# Altium project PCB_TeknoFest.PrjPcb
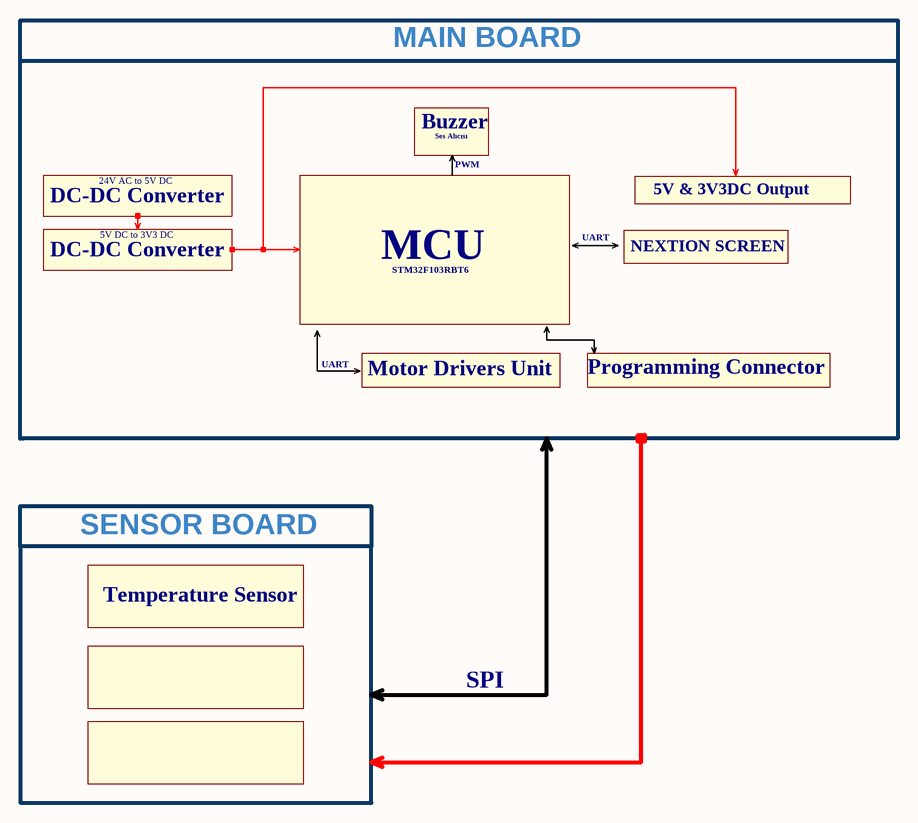
[diagram p0: BlockDiagram.SchDoc]
4 sheets, 69 parts. Net scope: flat (ports and power ports of the same name join across sheets).
Board file: TeknoFest.PcbDoc
Sheets:
  BlockDiagram.SchDoc
  MicroController.SchDoc
  PowerManagement.SchDoc
  MotorDriversUnit.SchDoc

## Sheet BlockDiagram.SchDoc
size A4; SheetNumber: 1; SheetTotal: 4

### Notes on the sheet
- MAIN BOARD
- Buzzer
- 24V AC to 5V DC
- Ses Alıcısı
- PWM
- 5V & 3V3DC Output
- DC-DC Converter
- 5V DC to 3V3 DC
- MCU
- UART
- NEXTION SCREEN
- STM32F103RBT6
- Motor Drivers Unit
- Programming Connector
- SENSOR BOARD
- Temperature Sensor
- SPI

## Sheet MicroController.SchDoc: Teknofest Project
size 381 x 241 mm; Date: 21/12/2023; SheetNumber: 2; SheetTotal: 4; Prepared by: Mustafa Oğuz Ateş
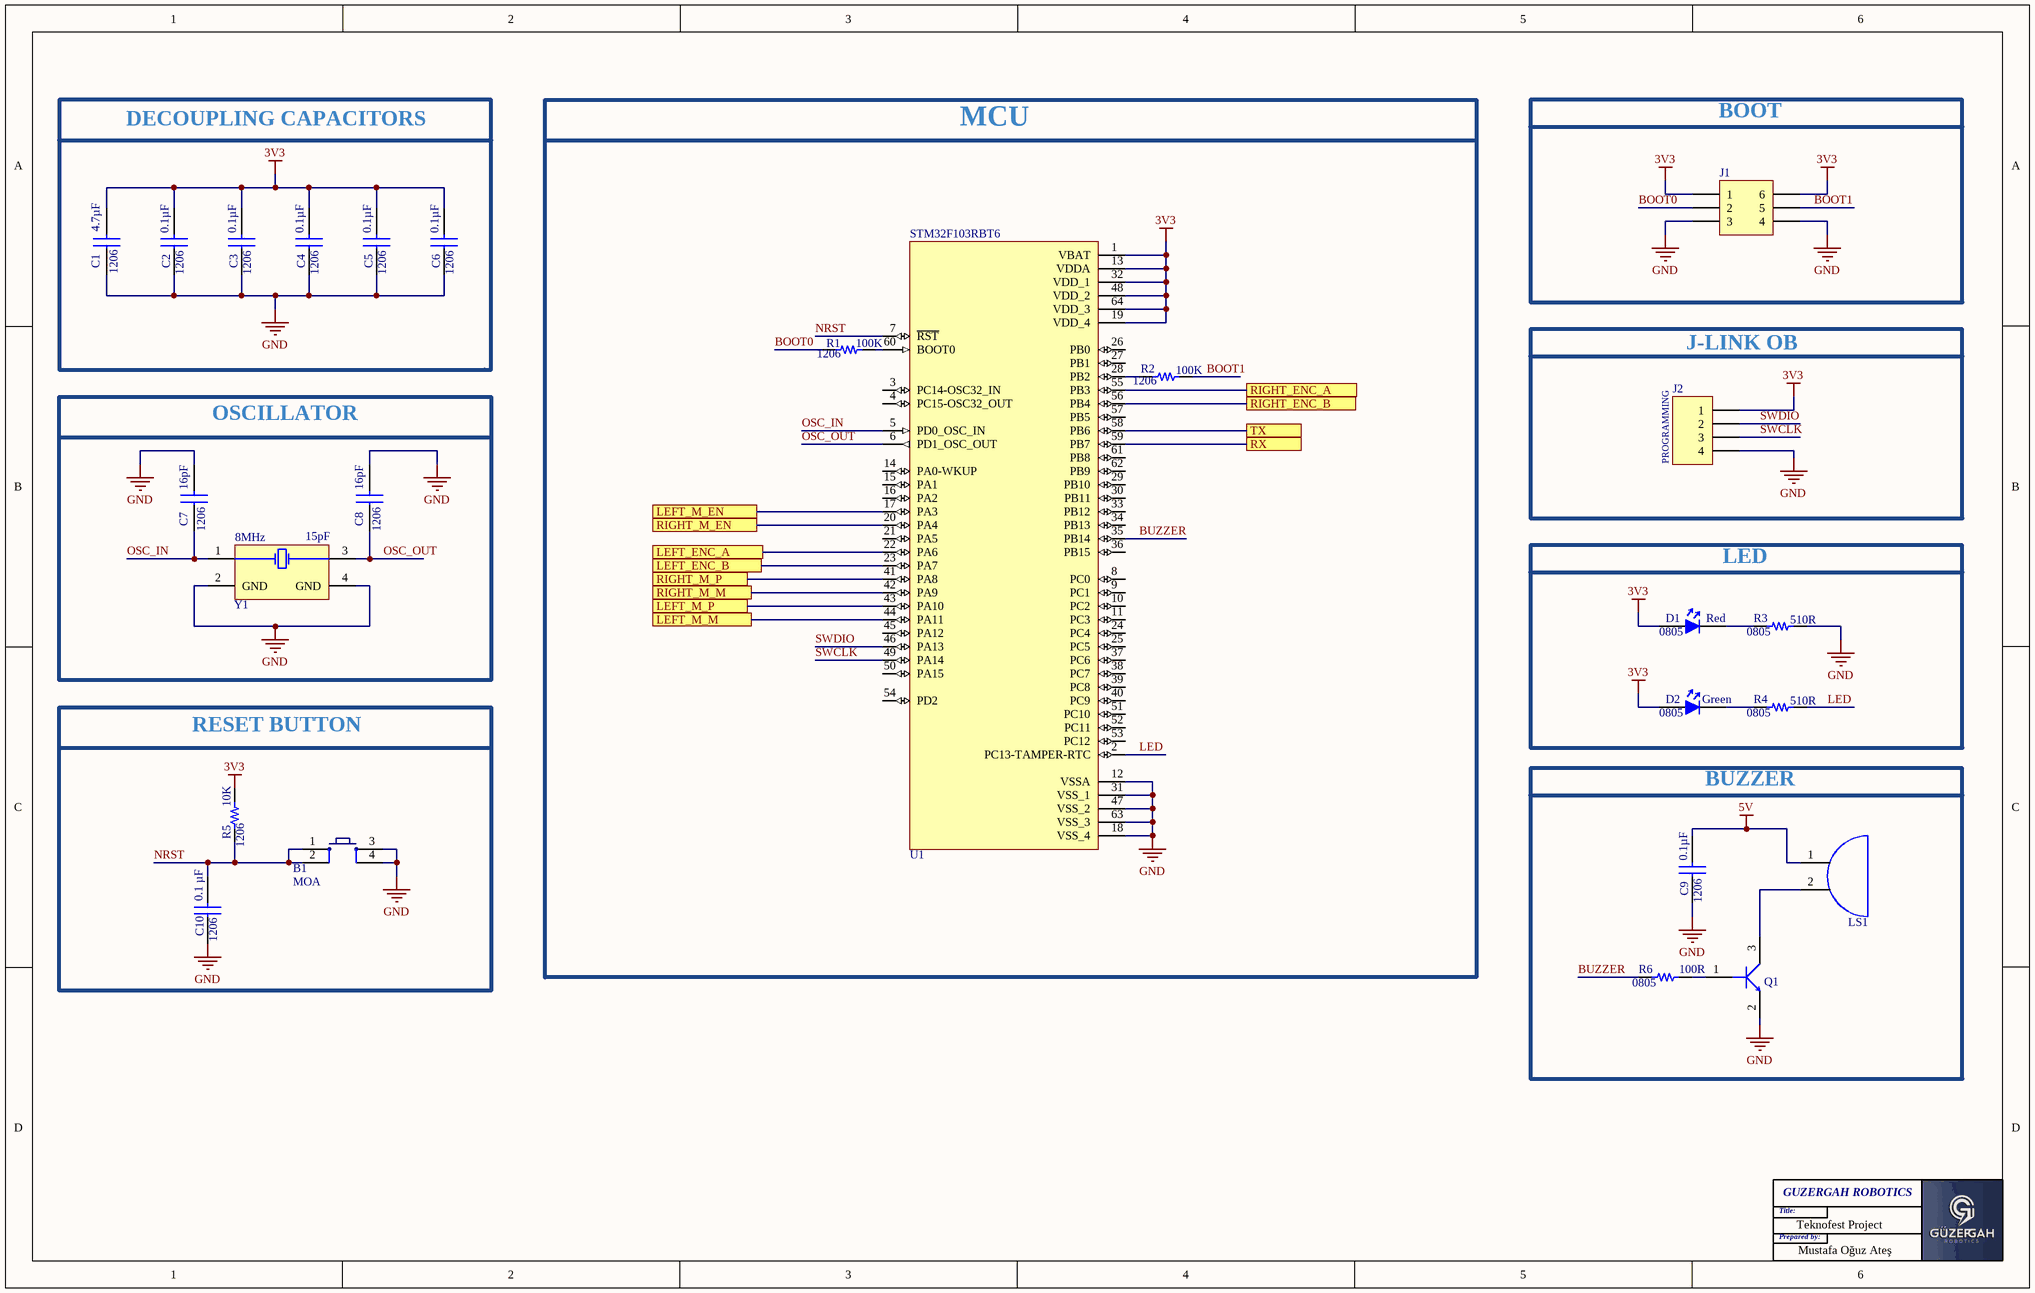
[diagram p1: MicroController.SchDoc]

### Parts
B1  Designed by: MOA  [PUSH BUTTON-SMD]  (hidden comment: Push Button)
C1  value 4.7µF  Package / Case: 1206  [CAP_1206_4.7uF]  (hidden comment: CAP CER 4.7 uF 1206)
C2  value 0.1µF  Package / Case: 1206  [CAP_1206_0.1uF]  (hidden comment: CAP_1206_0.1uF)
C3  value 0.1µF  Package / Case: 1206  [CAP_1206_0.1uF]  (hidden comment: CAP_1206_0.1uF)
C4  value 0.1µF  Package / Case: 1206  [CAP_1206_0.1uF]  (hidden comment: CAP_1206_0.1uF)
C5  value 0.1µF  Package / Case: 1206  [CAP_1206_0.1uF]  (hidden comment: CAP_1206_0.1uF)
C6  value 0.1µF  Package / Case: 1206  [CAP_1206_0.1uF]  (hidden comment: CAP_1206_0.1uF)
C7  value 16pF  Package / Case: 1206  [CAP_1206_16pF]  (hidden comment: CAP_1206_16pF)
C8  value 16pF  Package / Case: 1206  [CAP_1206_16pF]  (hidden comment: CAP_1206_16pF)
C9  value 0.1µF  Package / Case: 1206  [CAP_1206_0.1uF]  (hidden comment: CAP_1206_0.1uF)
C10  value 0.1 µF  Package / Case: 1206  [CAP_1206_0.1uF]  (hidden comment: CAP_1206_0.1uF)
D1  Package / Case: 0805  Illumination Color: Red  [LED_RED_0805]  (hidden comment: LED RED 0805)
D2  Package / Case: 0805  Color: Green  [LED_GREEN_0805]  (hidden comment: LED GREEN 0805)
J1  L-KLS1-208Y-5.0-2-06-W-8  [BOOT_HEADER_2.54MM_2X3PINS]  (value not drawn)
J2  DS1023-1X4S21  [J-LINK OB]  (value not drawn)
LS1  CMI-9605IC-0580T  [BUZZER]  (value not drawn)
Q1  MMBT3904-7-F  [SOT-23F]  (value not drawn)
R1  value 100K  Package / Case: 1206  [RES_1206_100K]  (hidden comment: RES_1206_10K)
R2  value 100K  Package / Case: 1206  [RES_1206_100K]  (hidden comment: RES_1206_10K)
R3  value 510R  Package / Case: 0805  [RES_0805_510R]  (hidden comment: RES_0805_510R)
R4  value 510R  Package / Case: 0805  [RES_0805_510R]  (hidden comment: RES_0805_510R)
R5  value 10K  Package / Case: 1206  [RES_1206_10k]  (hidden comment: RES_1206_10K)
R6  value 100R  Package / Case: 0805  [RES_0805_100R]  (hidden comment: RES_0805_100R)
U1  STM32F103RBT6  [LQFP-64]
Y1  Frequency: 8MHz  Capacitance: 15pF  [8MHz-OSC]  (hidden comment: ECS-2033-080-AU)

### Blocks framed on the sheet
DECOUPLING CAPACITORS: C1-C6
BOOT: J1
MCU: R1 R2 U1
J-LINK OB: J2
LED: D1 D2 R3 R4
BUZZER: C9 LS1 Q1 R6

### Ports
LEFT_ENC_A, LEFT_ENC_B, LEFT_M_EN, LEFT_M_M, LEFT_M_P, RIGHT_ENC_A, RIGHT_ENC_B, RIGHT_M_EN, RIGHT_M_M, RIGHT_M_P, RX, TX

### Nets
3V3: C1.2 C2.2 C3.2 C4.2 C5.2 C6.2 D1.2 D2.2 J1.1 J1.6 J2.1 R5.2 U1.1(VBAT) U1.13(VDDA) U1.19(VDD_4) U1.32(VDD_1) U1.48(VDD_2) U1.64(VDD_3)
5V: C9.2 LS1.1
GND: B1.3 B1.4 C1.1 C2.1 C3.1 C4.1 C5.1 C6.1 C7.2 C8.2 C9.1 C10.1 J1.3 J1.4 J2.4 Q1.2(E) R3.2 U1.12(VSSA) U1.18(VSS_4) U1.31(VSS_1) U1.47(VSS_2) U1.63(VSS_3) Y1.2(GND) Y1.4(GND)
BOOT0: J1.2 R1.1
BOOT1: J1.5 R2.2
BUZZER: R6.1 U1.35(PB14)
LED: R4.2 U1.2(PC13-TAMPER-RTC)
NRST: B1.1 B1.2 C10.2 R5.1 U1.7(~{RST})
OSC_IN: C7.1 U1.5(PD0_OSC_IN) Y1.1(Tristate)
OSC_OUT: C8.1 U1.6(PD1_OSC_OUT) Y1.3(OUT)
SWCLK: J2.3 U1.49(PA14)
SWDIO: J2.2 U1.46(PA13)
NetD1_1: D1.1 R3.1
NetD2_1: D2.1 R4.1
NetJ3_2: U1.58(PB6) ; port TX
NetJ3_3: U1.59(PB7) ; port RX
NetJ10_1: U1.17(PA3) ; port LEFT_M_EN
NetJ10_2: U1.43(PA10) ; port LEFT_M_P
NetJ10_3: U1.44(PA11) ; port LEFT_M_M
NetJ11_1: U1.20(PA4) ; port RIGHT_M_EN
NetJ11_2: U1.41(PA8) ; port RIGHT_M_P
NetJ11_3: U1.42(PA9) ; port RIGHT_M_M
NetJ12_2: U1.55(PB3) ; port RIGHT_ENC_A
NetJ12_3: U1.56(PB4) ; port RIGHT_ENC_B
NetJ13_2: U1.22(PA6) ; port LEFT_ENC_A
NetJ13_3: U1.23(PA7) ; port LEFT_ENC_B
NetLS1_2: LS1.2 Q1.3(C)
NetQ1_1: Q1.1(B) R6.2
NetR1_2: R1.2 U1.60(BOOT0)
NetR2_1: R2.1 U1.28(PB2)

Not connected (* = marked no-connect by the designer): U1 3(PC14-OSC32_IN) 4(PC15-OSC32_OUT) 8(PC0) 9(PC1) 10(PC2) 11(PC3) 14(PA0-WKUP) 15(PA1) 16(PA2) 21(PA5) 24(PC4) 25(PC5) 26(PB0) 27(PB1) 29(PB10) 30(PB11) 33(PB12) 34(PB13) 36(PB15) 37(PC6) 38(PC7) 39(PC8) 40(PC9) 45(PA12) 50(PA15) 51(PC10) 52(PC11) 53(PC12) 54(PD2) 57(PB5) 61(PB8) 62(PB9)

### Notes on the sheet
- OSCILLATOR
- (near J2) PROGRAMMING
- RESET BUTTON
- Title:
- Prepared by:
- GUZERGAH ROBOTICS

### Library data of the parts
B1 = Push Button: KOMPONENT SEÇİLMEDİ SMD Push Button; Satın Alma Linki: https://urun.n11.com/diger/mini-pushbutton-switch-smd-P227461537?gclid=Cj0KCQjwkoDmBRCcARIsAG3xzl8Y_-jeD7HocNM6lvuZ_rVp83568XPGtNzlPwXWLph8oCRqo0yh87UaApZYEALw_wcB&gclsrc=aw.ds
C1 = CAP_1206_4.7uF
C2-C6 C9 C10 = CAP_1206_0.1uF: CAP CER 0.1 uF 1206
C7 C8 = CAP_1206_16pF: CAP CER 16pF 1206
D1 = LED RED 0805: KOMPONENT SEÇİLMEDİ; Manufacturer: Osram Opto; Manufacturer Part Number: LH R974-LP-1; Lens Color: White; Forward Voltage: 1.8V; Lens Style: Diffused,Flat,Colorless; Luminous Intensity: 71mcd; Viewing Angle: 160°; Forward Current: 30mA; Dominant Wavelength: 645nm; Number of Elements: 1; Test Current: 20mA; Reverse Voltage: 5V; Lens Transparency: Diffused; Luminous Flux: 0.17lm; Lens Size: 1.25mm; Designed by: Mustafa; Supplier 1: Digi-Key; RoHS: Yes; Category: LEDs; Stock 1: 35632; Pricing 1: 1=0,26000, 10=0,13900, 100=0,06480, 500=0,05978, 1000=0,04683, 2000=0,04584 (USD); Mount: Surface Mount; Number of Pins: 2; Color: Red; Case Code (Imperial): 0805; Case Code (Metric): 2012; Min Operating Temperature: -30°C; Max Operating Temperature: 85°C; Packaging: Tape and Reel; Package Quantity: 1; Series: CHipLED; Length: 2.1mm; Width: 1.25mm; Depth: 1.35mm; Radiation Hardening: No; RoHS Compliant: Yes; ComponentLink1URL: http://www.jameco.com/Jameco/Products/ProdDS/2085634.pdf?src-supplier=Jameco; ComponentLink1Description: http://www.jameco.com/Jameco/Products/ProdDS/2085634.pdf?src-supplier=Jameco; ComponentLink2URL: http://components.arrow.com/part/dataview/0323_01825492?src-supplier=Arrow+Europe; ComponentLink2Description: http://components.arrow.com/part/dataview/0323_01825492?src-supplier=Arrow+Europe; ComponentLink3URL: https://dammedia.osram.info/media/resource/hires/osram-dam-2493888/LH%20R974.pdf?src-supplier=Digi-Key; ComponentLink3Description: https://dammedia.osram.info/media/resource/hires/osram-dam-2493888/LH%20R974.pdf?src-supplier=Digi-Key; ComponentLink4URL: http://www.mouser.com/ds/2/311/LH%20R974%20-%20CHIPLED%200805-318659.pdf?src-supplier=Mouser; ComponentLink4Description: http://www.mouser.com/ds/2/311/LH%20R974%20-%20CHIPLED%200805-318659.pdf?src-supplier=Mouser; ComponentLink5URL: https://www.verical.com/server-webapp/html/getDatasheet?partID=258950&src-supplier=Verical; ComponentLink5Description: https://www.verical.com/server-webapp/html/getDatasheet?partID=258950&src-supplier=Verical; ComponentLink6URL: http://components.arrow.com/part/dataview/41971690S1077610N9133?src-supplier=Arrow+Electronics; ComponentLink6Description: http://components.arrow.com/part/dataview/41971690S1077610N9133?src-supplier=Arrow+Electronics; ComponentLink7URL: http://components.arrow.com/part/dataview/41971690S6190115N2128?src-supplier=Arrow+Electronics; ComponentLink7Description: http://components.arrow.com/part/dataview/41971690S6190115N2128?src-supplier=Arrow+Electronics; Supplier Part Number 1: 475-1415-1-ND
D2 = LED GREEN 0805: KOMPONENT SEÇİLMEDİ; Manufacturer: Vishay Lite-On; Manufacturer Part Number: LTST-C171GKT; Designed by: Mustafa; Lens Color: Colorless; Viewing Angle: 130°; Lens Style: Diffused,Colorless,Rectangular,Clear; Luminous Intensity: 12mcd; Forward Current: 30mA; Forward Voltage: 2.1V; Power Rating: 100mW; Dominant Wavelength: 569nm; Test Current: 10mA; Lens Transparency: Clear; Number of Elements: 1; Wavelength: 585nm; Reverse Voltage: 5V; Supplier 1: Digi-Key; RoHS: Yes; Category: LEDs; Stock 1: 159023; Pricing 1: 1=0,26000, 10=0,14100, 100=0,06560, 500=0,06060, 1000=0,04747 (USD); Mount: Surface Mount; Number of Pins: 2; Case Code (Metric): 2012; Case Code (Imperial): 0805; Min Operating Temperature: -55°C; Max Operating Temperature: 85°C; Package Quantity: 1; Packaging: Tape and Reel; Illumination Color: Green; Power Dissipation: 100mW; Number of LEDs: 1; Series: CHIPLED 0805; Length: 2mm; Width: 1.25mm; Height: 0.8mm; Depth: 1.25mm; Radiation Hardening: No; Lead Free: Lead Free; RoHS Compliant: Yes; ComponentLink1URL: https://datasheet.ciiva.com/2110/ltst-c171gkt-2110000.pdf?src-supplier=Digi-Key; ComponentLink1Description: https://datasheet.ciiva.com/2110/ltst-c171gkt-2110000.pdf?src-supplier=Digi-Key; ComponentLink2URL: https://datasheet.ciiva.com/11773/0900766b80dc0296-11773991.pdf?src-supplier=RSComponents; ComponentLink2Description: https://datasheet.ciiva.com/11773/0900766b80dc0296-11773991.pdf?src-supplier=RSComponents; ComponentLink3URL: https://datasheet.ciiva.com/12400/lite-on-ltst-c171gkt-190133-12400647.pdf?src-supplier=Mouser; ComponentLink3Description: https://datasheet.ciiva.com/12400/lite-on-ltst-c171gkt-190133-12400647.pdf?src-supplier=Mouser; ComponentLink4URL: https://datasheet.ciiva.com/2110/ltst-c171gkt-2110001.pdf?src-supplier=Digi-Key; ComponentLink4Description: https://datasheet.ciiva.com/2110/ltst-c171gkt-2110001.pdf?src-supplier=Digi-Key; ComponentLink5URL: https://datasheet.ciiva.com/2110/ltst-c171gkt-2110002.pdf?src-supplier=Digi-Key; ComponentLink5Description: https://datasheet.ciiva.com/2110/ltst-c171gkt-2110002.pdf?src-supplier=Digi-Key; ComponentLink6URL: https://datasheet.ciiva.com/16396/ltst-c171gkt-16396549.pdf?src-supplier=Future+Electronics; ComponentLink6Description: https://datasheet.ciiva.com/16396/ltst-c171gkt-16396549.pdf?src-supplier=Future+Electronics; Supplier Part Number 1: 160-1423-1-ND
J1 = BOOT_HEADER: FEMALE HEADER 6PIN(2X3) 2.54MM THT V/T 8x7.62 TUBE; ComponentLink1Description: New link; ComponentLink1URL: https://ozdisan.com/Product/Detail/652771/L-KLS1-208Y-5-0-2-06-W-8
J2 = J-LINK OB: FEMALE HEADER 4PIN(1x4) 2.54mm THT V/T TRAY; ComponentLink1Description: New link; ComponentLink1URL: https://ozdisan.com/konnektor-ve-baglanti-elemanlari/header-konnektorler/disi-headerlar/DS1023-1X4S21/353863
LS1 = BUZZER: Audio Buzzer Magnetic 3VDC 7VDC 30mA 5VDC 85dB 2600Hz to 2800Hz Through Hole Pin Box; Manufacturer: CUI Devices; Designed by: MOA; Supplier: Digi-Key; Supplier Part Number: 2223-CMI-9605IC-0580T-ND; Manufacturer Part Number: CMI-9605IC-0580T; RoHS: No; Category: Audio Products; Stock: 5910; Pricing: 1=1,22, 10=1,014, 25=0,938, 50=0,883, 100=0,8298, 250=0,76976, 500=0,71396, 1000=0,66741, 5000=0,65403 (USD); Case/Package: CMI-9605IC
Q1 = BJT_NPN_TRANSISTOR: MMBT3904-7-F - TRANSISTOR DIS.200mA 40V NPN SOT23 SMT/ ÖZDİSAN; Manufacturer: Diodes Zetex; Designed by: MOA; Max Power Dissipation: 300mW; Max Collector Current: 200mA; Collector Base Voltage (VCBO): 60V; Frequency: 300MHz; hFE Min: 100; Number of Elements: 1; Emitter Base Voltage (VEBO): 6V; Collector Emitter Saturation Voltage: 300mV; Power Dissipation: 350mW; Element Configuration: Single; Manufacturer Part Number: MMBT3904-7-F; RoHS: Yes; Category: BJTs; Stock 1: 2393281; Pricing 1: 1=0,12000, 10=0,08600, 25=0,08280, 100=0,04660, 500=0,03664, 1000=0,02544 (USD); Mount: Surface Mount; Case/Package: SOT-23; Number of Pins: 3; Weight: 0.000282oz; Contact Plating: Tin,Matte; Min Operating Temperature: -55°C; Max Operating Temperature: 150°C; Collector Emitter Voltage (VCEO): 40V; Polarity: NPN; Packaging: Tape and Reel; Package Quantity: 3000; Transition Frequency: 300MHz; Collector Emitter Breakdown Voltage: 40V; Max Breakdown Voltage: 40V; Continuous Collector Current: 200mA; Max Frequency: 300MHz; Gain Bandwidth Product: 300MHz; Series: -; Collector-emitter Voltage-Max: 300mV; Voltage Rating (DC): 40V; Length: 3.05mm; Width: 1.4mm; Height: 1mm; Radiation Hardening: No; REACH SVHC: No SVHC; Lead Free: Lead Free; RoHS Compliant: Yes; ComponentLink1URL: https://datasheet.ciiva.com/11201/ds30036-11201778.pdf?src-supplier=Avnet; ComponentLink1Description: https://datasheet.ciiva.com/11201/ds30036-11201778.pdf?src-supplier=Avnet; Supplier Part Number 1: MMBT3904-FDIDKR-ND; ComponentLink7Description: New link; ComponentLink7URL: https://ozdisan.com/Product/Detail/609899/MMBT3904-7-F
R1 R2 = RES_1206_100K: RES 1206 100K ohm
R3 R4 = RES_0805_510R: RES 0805 510 ohm
R5 = RES_1206_10K: RES 1206 10K ohm
R6 = RES_0805_100R: RES 0805 100 ohm
U1 = STM32F103RBT6: STM32F103RTB6 LQFP-64; MF: STMicroelectronics; Designed by: MOA; Package: LQFP-64 STMicroelectronics; Price: None; Check_prices: https://www.snapeda.com/parts/STM32F103RBT6/STMicroelectronics/view-part/?ref=eda; Value: *; SnapEDA_Link: https://www.snapeda.com/parts/STM32F103RBT6/STMicroelectronics/view-part/?ref=snap; MP: STM32F103RBT6; Availability: In Stock; Purchase-URL: https://pricing.snapeda.com/search?q=STM32F103RBT6&ref=eda
Y1 = OSI_8MHz_15pF: CRYSTAL OSCILLATOR XO 8.0000MHZ CMOS SMD; Designed by: MOA; ComponentLink1Description: New link; ComponentLink1URL: https://ozdisan.com/pasif-komponentler/kristaller-osilatorler-ve-rezanatorler/osilatorler/ECS-2033-080-AU/994835

## Sheet PowerManagement.SchDoc: Teknofest Project
size A4; SheetNumber: 3; SheetTotal: 4; Prepared by: Mustafa Oğuz Ateş
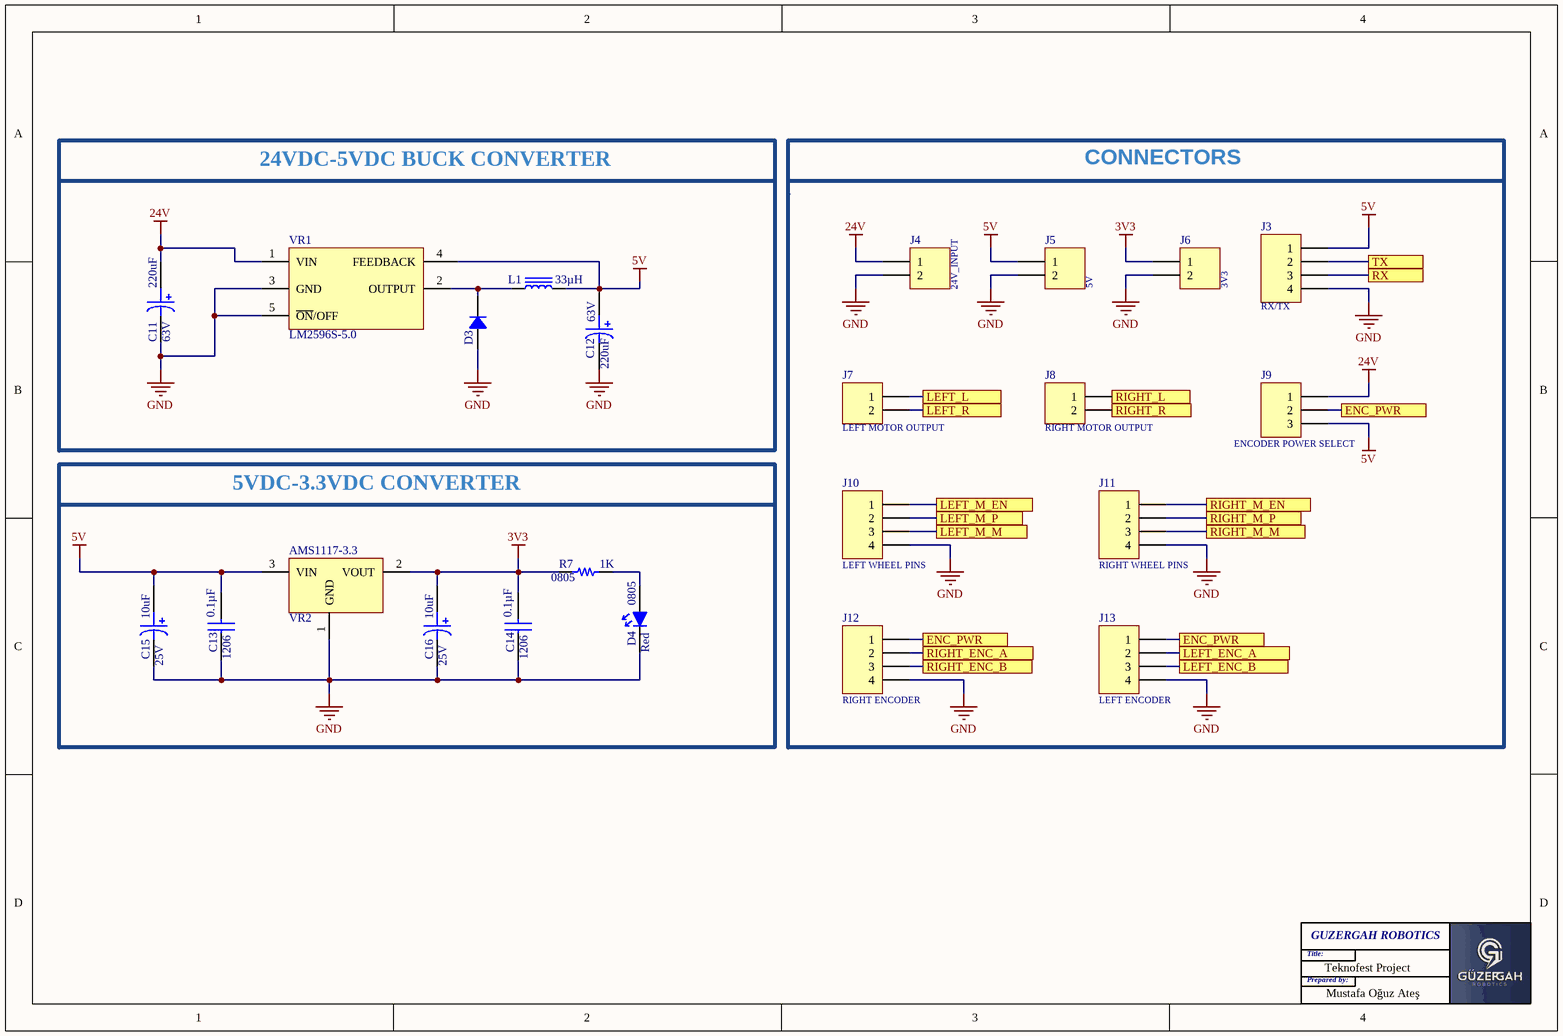
[diagram p2: PowerManagement.SchDoc]

### Parts
C11  value 220uF  Voltage - Rated: 63V  [CAP_ALUM_220uF_10x16 5MM]  (hidden comment: RD1J227M10016PA100)
C12  value 220uF  Voltage - Rated: 63V  [CAP_ALUM_220uF_10x16 5MM]  (hidden comment: RD1J227M10016PA100)
C13  value 0.1µF  Package / Case: 1206  [CAP_1206_0.1uF]  (hidden comment: CAP_1206_0.1uF)
C14  value 0.1µF  Package / Case: 1206  [CAP_1206_0.1uF]  (hidden comment: CAP_1206_0.1uF)
C15  value 10uF  Voltage - Rated: 25V  [CAP_ALUM_10uF_TH]  (hidden comment: PKRJ-025V100MB070)
C16  value 10uF  Voltage - Rated: 25V  [CAP_ALUM_10uF_TH]  (hidden comment: PKRJ-025V100MB070)
D3  SK56-HT  [DIODE SCHOTTKY]  (value not drawn)
D4  Package / Case: 0805  Color: Red  [LED_RED_0805]  (hidden comment: LED RED 0805)
J3  DS1023-1X4S21  [RX/TX HEADER]  (value not drawn)
J4  DG381S-3.81-02P-14-00AH  [24V_IN KONNEKTÖR]  (value not drawn)
J5  L-KLS1-208-1-02-S  [5V JUMPER]  (value not drawn)
J6  L-KLS1-208-1-02-S  [3V3 JUMPER]  (value not drawn)
J7  DG381S-3.81-02P-14-00AH  [LEFT MOTOR OUTPUT CONNECTOR]  (value not drawn)
J8  DG381S-3.81-02P-14-00AH  [RIGHT MOTOR OUTPUT CONNECTOR]  (value not drawn)
J9  DS1023-1X3S21  [ENCODER POWER SELECT.1]  (value not drawn)
J10  DS1023-1X4S21  [LEFT WHEEL PINS]  (value not drawn)
J11  DS1023-1X4S21  [RIGHT WHEEL PINS]  (value not drawn)
J12  15EDGA-3.81-04P-14-00AH  [RIGHT ENCODER]  (value not drawn)
J13  15EDGA-3.81-04P-14-00AH  [LEFT ENCODER]  (value not drawn)
L1  value 33µH  [INDUCTOR POWER]  (hidden comment: SRR1280-330M)
R7  value 1K  Package / Case: 0805  [RES_0805_1K]  (hidden comment: RES_0805_1K)
VR1  LM2596S-5.0  [TO263-5 (D2PAK)]
VR2  AMS1117-3.3  [SOT-223]

### Blocks framed on the sheet
24VDC-5VDC BUCK CONVERTER: C11 C12 D3 L1 VR1
CONNECTORS: J3-J13
5VDC-3.3VDC CONVERTER: C13-C16 D4 R7 VR2

### Ports
ENC_PWR, LEFT_ENC_A, LEFT_ENC_B, LEFT_L, LEFT_M_EN, LEFT_M_M, LEFT_M_P, LEFT_R, RIGHT_ENC_A, RIGHT_ENC_B, RIGHT_L, RIGHT_M_EN, RIGHT_M_M, RIGHT_M_P, RIGHT_R, RX, TX

### Nets
3V3: C14.2 C16.1 J6.1 R7.1 VR2.2(VOUT)
5V: C12.1 C13.2 C15.1 J3.1 J5.1 J9.3 L1.2 VR2.3(VIN)
24V: C11.1 J4.1 J9.1 VR1.1(VIN)
GND: C11.2 C12.2 C13.1 C14.1 C15.2 C16.2 D3.2 D4.1 J3.4 J4.2 J5.2 J6.2 J10.4 J11.4 J12.4 J13.4 VR1.3(GND) VR1.5(~{ON}/OFF) VR2.1(GND)
NetD3_1: D3.1 L1.1 VR1.2(OUTPUT)
NetD4_2: D4.2 R7.2
NetJ3_2: J3.2 ; port TX
NetJ3_3: J3.3 ; port RX
NetJ7_1: J7.1 ; port LEFT_L
NetJ7_2: J7.2 ; port LEFT_R
NetJ8_1: J8.1 ; port RIGHT_L
NetJ8_2: J8.2 ; port RIGHT_R
NetJ9_2: J9.2 J12.1 J13.1 ; port ENC_PWR
NetJ10_1: J10.1 ; port LEFT_M_EN
NetJ10_2: J10.2 ; port LEFT_M_P
NetJ10_3: J10.3 ; port LEFT_M_M
NetJ11_1: J11.1 ; port RIGHT_M_EN
NetJ11_2: J11.2 ; port RIGHT_M_P
NetJ11_3: J11.3 ; port RIGHT_M_M
NetJ12_2: J12.2 ; port RIGHT_ENC_A
NetJ12_3: J12.3 ; port RIGHT_ENC_B
NetJ13_2: J13.2 ; port LEFT_ENC_A
NetJ13_3: J13.3 ; port LEFT_ENC_B

Not connected (* = marked no-connect by the designer): VR1 4(FEEDBACK)

### Notes on the sheet
- (near J4) 24V_INPUT
- (near J5) 5V
- (near J6) 3V3
- (near J3) RX/TX
- (near J7) LEFT MOTOR OUTPUT
- (near J8) RIGHT MOTOR OUTPUT
- (near J9) ENCODER POWER SELECT
- (near J10) LEFT WHEEL PINS
- (near J11) RIGHT WHEEL PINS
- (near J12) RIGHT ENCODER
- (near J13) LEFT ENCODER
- Title:
- Prepared by:
- GUZERGAH ROBOTICS
- (in symbol AMS1117-3.3) /

### Library data of the parts
C11 C12 = CAP_ALUM_220uF_TH: CAP.EL.220uF 63V 10x16 5MM 105C
C13 C14 = CAP_1206_0.1uF: CAP CER 0.1 uF 1206
C15 C16 = CAP_ALUM_10uF_TH: CAP.EL.10uF 25V 4x7 1.5MM 105C BULK KOSHIN; ComponentLink1Description: New link; ComponentLink1URL: https://www.ozdisan.com/pasif-komponentler/kapasitorler/aluminyum-kapasitorler/PKRJ-025V100MB070/345328
D3 = DIODE SCHOTTKY: 5A 60V DO214AB SMC
D4 = LED RED 0805: as D1 on sheet MicroController; Supplier 1: Digi-Key; RoHS: Yes; Category: LEDs; Stock 1: 35632; Pricing 1: 1=0,26000, 10=0,13900, 100=0,06480, 500=0,05978, 1000=0,04683, 2000=0,04584 (USD); Mount: Surface Mount; Number of Pins: 2; Case Code (Imperial): 0805; Case Code (Metric): 2012; Min Operating Temperature: -30°C; Max Operating Temperature: 85°C; Packaging: Tape and Reel; Illumination Color: Red; Package Quantity: 1; Series: CHipLED; Length: 2.1mm; Width: 1.25mm; Depth: 1.35mm; Radiation Hardening: No; RoHS Compliant: Yes; ComponentLink1URL: http://www.jameco.com/Jameco/Products/ProdDS/2085634.pdf?src-supplier=Jameco; ComponentLink1Description: http://www.jameco.com/Jameco/Products/ProdDS/2085634.pdf?src-supplier=Jameco; ComponentLink2URL: http://components.arrow.com/part/dataview/0323_01825492?src-supplier=Arrow+Europe; ComponentLink2Description: http://components.arrow.com/part/dataview/0323_01825492?src-supplier=Arrow+Europe; ComponentLink3URL: https://dammedia.osram.info/media/resource/hires/osram-dam-2493888/LH%20R974.pdf?src-supplier=Digi-Key; ComponentLink3Description: https://dammedia.osram.info/media/resource/hires/osram-dam-2493888/LH%20R974.pdf?src-supplier=Digi-Key; ComponentLink4URL: http://www.mouser.com/ds/2/311/LH%20R974%20-%20CHIPLED%200805-318659.pdf?src-supplier=Mouser; ComponentLink4Description: http://www.mouser.com/ds/2/311/LH%20R974%20-%20CHIPLED%200805-318659.pdf?src-supplier=Mouser; ComponentLink5URL: https://www.verical.com/server-webapp/html/getDatasheet?partID=258950&src-supplier=Verical; ComponentLink5Description: https://www.verical.com/server-webapp/html/getDatasheet?partID=258950&src-supplier=Verical; ComponentLink6URL: http://components.arrow.com/part/dataview/41971690S1077610N9133?src-supplier=Arrow+Electronics; ComponentLink6Description: http://components.arrow.com/part/dataview/41971690S1077610N9133?src-supplier=Arrow+Electronics; ComponentLink7URL: http://components.arrow.com/part/dataview/41971690S6190115N2128?src-supplier=Arrow+Electronics; ComponentLink7Description: http://components.arrow.com/part/dataview/41971690S6190115N2128?src-supplier=Arrow+Electronics; Supplier Part Number 1: 475-1415-1-ND
J3 = RX/TX HEADER: FEMALE HEADER 4PIN(1x4) 2.54mm THT V/T TRAY; ComponentLink1Description: New link; ComponentLink1URL: https://ozdisan.com/konnektor-ve-baglanti-elemanlari/header-konnektorler/disi-headerlar/DS1023-1X4S21/353863
J4 = 24V_IN: TERM.BLK.3.81MM 2P PCB TYPE GREEN; ComponentLink1Description: New link; ComponentLink1URL: https://ozdisan.com/Product/Detail/440917/DG381S-3-81-02P-14-00AH
J5 = 5V_JUMPER_HEADER: FEMALE HEADER 2PIN(1x2) 2.54mm THT V/T TRAY; ComponentLink1Description: New link; ComponentLink1URL: https://ozdisan.com/konnektor-ve-baglanti-elemanlari/header-konnektorler/disi-headerlar/L-KLS1-208-1-02-S/596182
J6 = 3V3_JUMPER_HEADER: FEMALE HEADER 2PIN(1x2) 2.54mm THT V/T TRAY; ComponentLink1Description: New link; ComponentLink1URL: https://ozdisan.com/konnektor-ve-baglanti-elemanlari/header-konnektorler/disi-headerlar/L-KLS1-208-1-02-S/596182
J7 = LEFT MOTOR OUTPUT: DG381S-3.81-02P-14-00AH - TERM.BLK.3.81MM 2P PCB TYPE GREEN
J8 = RIGHT MOTOR OUTPUT: DG381S-3.81-02P-14-00AH - TERM.BLK.3.81MM 2P PCB TYPE GREEN
J9 = ENCODER POWER SELECT: FEMALE HEADER 3PIN(1x3) 2.54mm THT V/T; ComponentLink1Description: New link; ComponentLink1URL: https://ozdisan.com/konnektor-ve-baglanti-elemanlari/header-konnektorler/disi-headerlar/DS1023-1X3S21/702380
J10 = LEFT WHEEL PINS: FEMALE HEADER 4PIN(1x4) 2.54mm THT V/T TRAY; ComponentLink1Description: New link; ComponentLink1URL: https://ozdisan.com/konnektor-ve-baglanti-elemanlari/header-konnektorler/disi-headerlar/DS1023-1X4S21/353863
J11 = RIGHT WHEEL PINS: DS1023-1X4S21 - FEMALE HEADER 4PIN(1x4) 2.54mm THT V/T TRAY; ComponentLink1Description: New link; ComponentLink1URL: https://ozdisan.com/konnektor-ve-baglanti-elemanlari/header-konnektorler/disi-headerlar/DS1023-1X4S21/353863
J12 = RIGHT ENCODER: TERM.BLK.3.81MM 4P FEMALE GREEN; ComponentLink1Description: New link; ComponentLink1URL: https://ozdisan.com/Product/Detail/638461/15EDGA-3-81-04P-14-00AH
J13 = LEFT ENCODER: TERM.BLK.3.81MM 4P FEMALE GREEN KLEMENS; ComponentLink1Description: New link; ComponentLink1URL: https://ozdisan.com/konnektor-ve-baglanti-elemanlari/klemensler/pcb-klemensler/15EDGA-3-81-04P-14-00AH/638461
L1 = INDUCTOR_POWER_33uH: INDUCTOR POWER 33UH 3.5A SMD BOURNS
R7 = RES_0805_1K: RES 0805 1K ohm
VR1 = LM2596S-5.0: LM2596S-5.0 - IC-2596 REG BUCK 5V 3A TO263-5; ComponentLink1Description: New link; ComponentLink1URL: https://ozdisan.com/entegre-devreler-icler/guc-entegreleri/dc-dc-voltaj-regulatorleri/LM2596S-5-0
VR2 = AMS1117-3.3: IC-1117 V.REG. 1A 3V3 SOT223 SMD AMS; Manufacturer: UMW(Youtai Semiconductor Co., Ltd.); Designed by: Mustafa oğuz Ateş; Supplier: Digikey; Supplier Part Number: 4518-AMS1117-3.3CT-ND; Manufacturer Part Number: AMS1117-3.3; RoHS: No; Category: Uncategorized; Pricing: 1=0,48, 10=0,388, 25=0,3552, 100=0,2644, 250=0,2396, 500=0,19828, 1000=0,14871 (USD)

## Sheet MotorDriversUnit.SchDoc: Teknofest Project
size A4; SheetNumber: 4; SheetTotal: 4; Prepared by: Mustafa Oğuz ATEŞ
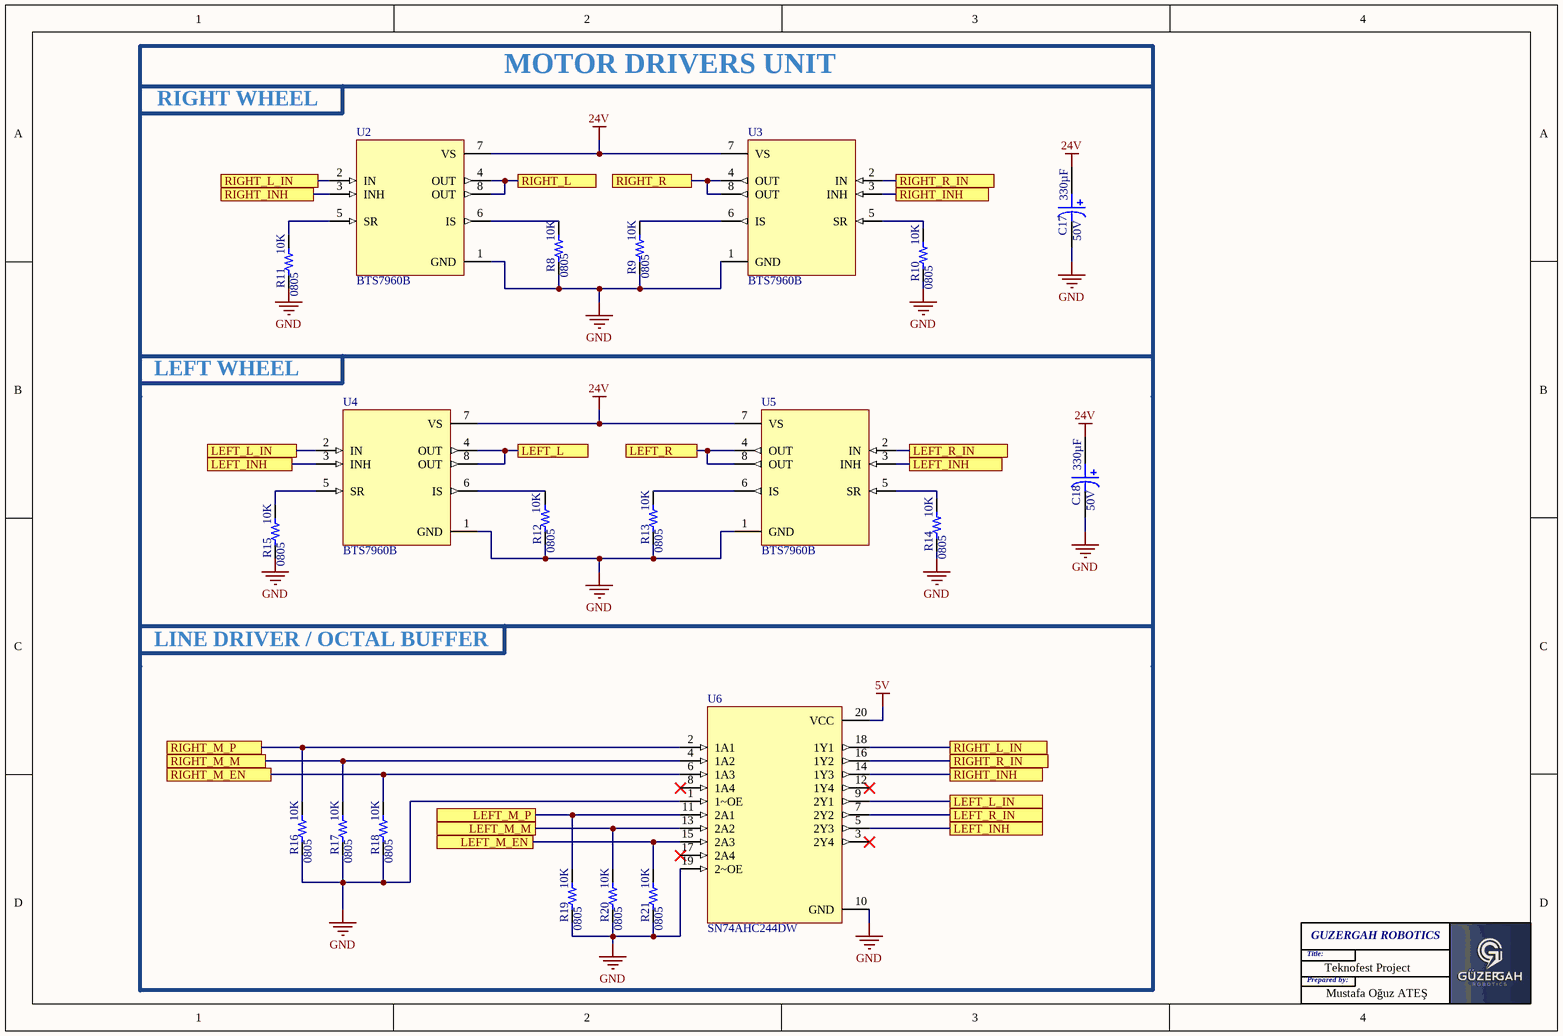
[diagram p3: MotorDriversUnit.SchDoc]

### Parts
C17  value 330µF  Voltage - Rated: 50V  [CAP_ALUM_330uF_10x17 5MM]  (hidden comment: CD11GCL-50V330-10X17)
C18  value 330µF  Voltage - Rated: 50V  [CAP_ALUM_330uF_10x17 5MM]  (hidden comment: CD11GCL-50V330-10X17)
R8  value 10K  Package / Case: 0805  [RES_0805_10K]  (hidden comment: RES_0805_10K)
R9  value 10K  Package / Case: 0805  [RES_0805_10K]  (hidden comment: RES_0805_10K)
R10  value 10K  Package / Case: 0805  [RES_0805_10K]  (hidden comment: RES_0805_10K)
R11  value 10K  Package / Case: 0805  [RES_0805_10K]  (hidden comment: RES_0805_10K)
R12  value 10K  Package / Case: 0805  [RES_0805_10K]  (hidden comment: RES_0805_10K)
R13  value 10K  Package / Case: 0805  [RES_0805_10K]  (hidden comment: RES_0805_10K)
R14  value 10K  Package / Case: 0805  [RES_0805_10K]  (hidden comment: RES_0805_10K)
R15  value 10K  Package / Case: 0805  [RES_0805_10K]  (hidden comment: RES_0805_10K)
R16  value 10K  Package / Case: 0805  [RES_0805_10K]  (hidden comment: RES_0805_10K)
R17  value 10K  Package / Case: 0805  [RES_0805_10K]  (hidden comment: RES_0805_10K)
R18  value 10K  Package / Case: 0805  [RES_0805_10K]  (hidden comment: RES_0805_10K)
R19  value 10K  Package / Case: 0805  [RES_0805_10K]  (hidden comment: RES_0805_10K)
R20  value 10K  Package / Case: 0805  [RES_0805_10K]  (hidden comment: RES_0805_10K)
R21  value 10K  Package / Case: 0805  [RES_0805_10K]  (hidden comment: RES_0805_10K)
U2  BTS7960B  [DPAK127P1490X440-8N]
U3  BTS7960B  [DPAK127P1490X440-8N]
U4  BTS7960B  [DPAK127P1490X440-8N]
U5  BTS7960B  [DPAK127P1490X440-8N]
U6  SN74AHC244DW  [SOIC-20]

### Ports
LEFT_INH, LEFT_L, LEFT_L_IN, LEFT_M_EN, LEFT_M_M, LEFT_M_P, LEFT_R, LEFT_R_IN, RIGHT_INH, RIGHT_L, RIGHT_L_IN, RIGHT_M_EN, RIGHT_M_M, RIGHT_M_P, RIGHT_R, RIGHT_R_IN

### Nets
5V: U6.20(VCC)
24V: C17.1 C18.1 U2.7(VS) U3.7(VS) U4.7(VS) U5.7(VS)
GND: C17.2 C18.2 R8.1 R9.1 R10.1 R11.1 R12.1 R13.1 R14.1 R15.1 R16.1 R17.1 R18.1 R19.1 R20.1 R21.1 U2.1(GND) U3.1(GND) U4.1(GND) U5.1(GND) U6.1(1~OE) U6.10(GND) U6.19(2~OE)
NetJ7_1: U4.4(OUT) U4.8(OUT) ; port LEFT_L
NetJ7_2: U5.4(OUT) U5.8(OUT) ; port LEFT_R
NetJ8_1: U2.4(OUT) U2.8(OUT) ; port RIGHT_L
NetJ8_2: U3.4(OUT) U3.8(OUT) ; port RIGHT_R
NetJ10_1: R21.2 U6.15(2A3) ; port LEFT_M_EN
NetJ10_2: R19.2 U6.11(2A1) ; port LEFT_M_P
NetJ10_3: R20.2 U6.13(2A2) ; port LEFT_M_M
NetJ11_1: R18.2 U6.6(1A3) ; port RIGHT_M_EN
NetJ11_2: R16.2 U6.2(1A1) ; port RIGHT_M_P
NetJ11_3: R17.2 U6.4(1A2) ; port RIGHT_M_M
NetR8_2: R8.2 U2.6(IS)
NetR9_2: R9.2 U3.6(IS)
NetR10_2: R10.2 U3.5(SR)
NetR11_2: R11.2 U2.5(SR)
NetR12_2: R12.2 U4.6(IS)
NetR13_2: R13.2 U5.6(IS)
NetR14_2: R14.2 U5.5(SR)
NetR15_2: R15.2 U4.5(SR)
NetU2_2: U2.2(IN) U6.18(1Y1) ; port RIGHT_L_IN
NetU2_3: U2.3(INH) U3.3(INH) U6.14(1Y3) ; port RIGHT_INH
NetU3_2: U3.2(IN) U6.16(1Y2) ; port RIGHT_R_IN
NetU4_2: U4.2(IN) U6.9(2Y1) ; port LEFT_L_IN
NetU4_3: U4.3(INH) U5.3(INH) U6.5(2Y3) ; port LEFT_INH
NetU5_2: U5.2(IN) U6.7(2Y2) ; port LEFT_R_IN

Not connected (* = marked no-connect by the designer): U6 3(2Y4)* 8(1A4)* 12(1Y4)* 17(2A4)*

### Notes on the sheet
- RIGHT WHEEL
- MOTOR DRIVERS UNIT
- LEFT WHEEL
- LINE DRIVER / OCTAL BUFFER
- Title:
- Prepared by:
- GUZERGAH ROBOTICS

### Library data of the parts
C17 C18 = CAP_ALUM_330uF_TH: CAP.EL.330UF 50V 10x17 5MM 105C
R8-R21 = RES_0805_10K: RES 0805 10K ohm
U6 = SN74AHC244DW: Buffer, Non-Inverting 2 Element 4 Bit per Element 3-State Output 20-SOIC

## Nets that join several sheets
3V3: MicroController (18 pins), PowerManagement (5 pins)
5V: MicroController (C9.2 LS1.1), PowerManagement (8 pins), MotorDriversUnit (U6.20)
24V: PowerManagement (C11.1 J4.1 J9.1 VR1.1), MotorDriversUnit (6 pins)
GND: MicroController (24 pins), PowerManagement (19 pins), MotorDriversUnit (23 pins)
NetJ3_2: MicroController (U1.58), PowerManagement (J3.2)
NetJ3_3: MicroController (U1.59), PowerManagement (J3.3)
NetJ7_1: PowerManagement (J7.1), MotorDriversUnit (U4.4 U4.8)
NetJ7_2: PowerManagement (J7.2), MotorDriversUnit (U5.4 U5.8)
NetJ8_1: PowerManagement (J8.1), MotorDriversUnit (U2.4 U2.8)
NetJ8_2: PowerManagement (J8.2), MotorDriversUnit (U3.4 U3.8)
NetJ10_1: MicroController (U1.17), PowerManagement (J10.1), MotorDriversUnit (R21.2 U6.15)
NetJ10_2: MicroController (U1.43), PowerManagement (J10.2), MotorDriversUnit (R19.2 U6.11)
NetJ10_3: MicroController (U1.44), PowerManagement (J10.3), MotorDriversUnit (R20.2 U6.13)
NetJ11_1: MicroController (U1.20), PowerManagement (J11.1), MotorDriversUnit (R18.2 U6.6)
NetJ11_2: MicroController (U1.41), PowerManagement (J11.2), MotorDriversUnit (R16.2 U6.2)
NetJ11_3: MicroController (U1.42), PowerManagement (J11.3), MotorDriversUnit (R17.2 U6.4)
NetJ12_2: MicroController (U1.55), PowerManagement (J12.2)
NetJ12_3: MicroController (U1.56), PowerManagement (J12.3)
NetJ13_2: MicroController (U1.22), PowerManagement (J13.2)
NetJ13_3: MicroController (U1.23), PowerManagement (J13.3)